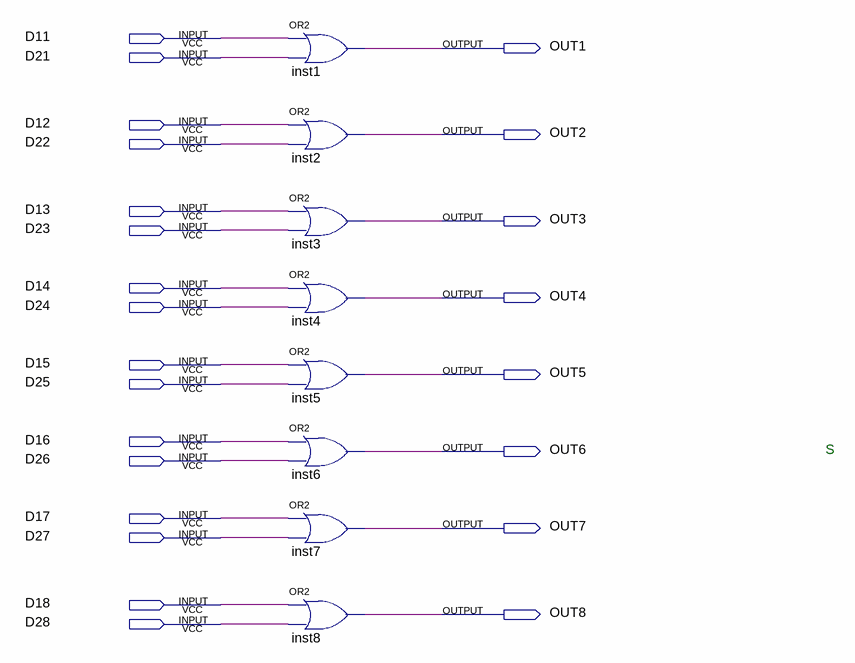
[diagram p0: schematic sheet]
// Quartus schematic OR08.bdf as structural Verilog: 8 symbols, 24 pins
module OR08 (
  input  D11,
  input  D21,
  input  D12,
  input  D22,
  input  D13,
  input  D23,
  input  D14,
  input  D24,
  input  D15,
  input  D25,
  input  D16,
  input  D26,
  input  D17,
  input  D27,
  input  D18,
  input  D28,
  output OUT1,
  output OUT2,
  output OUT3,
  output OUT4,
  output OUT5,
  output OUT6,
  output OUT7,
  output OUT8
);

  or inst1 (OUT1, D11, D21);
  or inst2 (OUT2, D12, D22);
  or inst3 (OUT3, D13, D23);
  or inst4 (OUT4, D14, D24);
  or inst5 (OUT5, D15, D25);
  or inst6 (OUT6, D16, D26);
  or inst7 (OUT7, D17, D27);
  or inst8 (OUT8, D18, D28);

  // Notes on the sheet:
  //   S
endmodule
